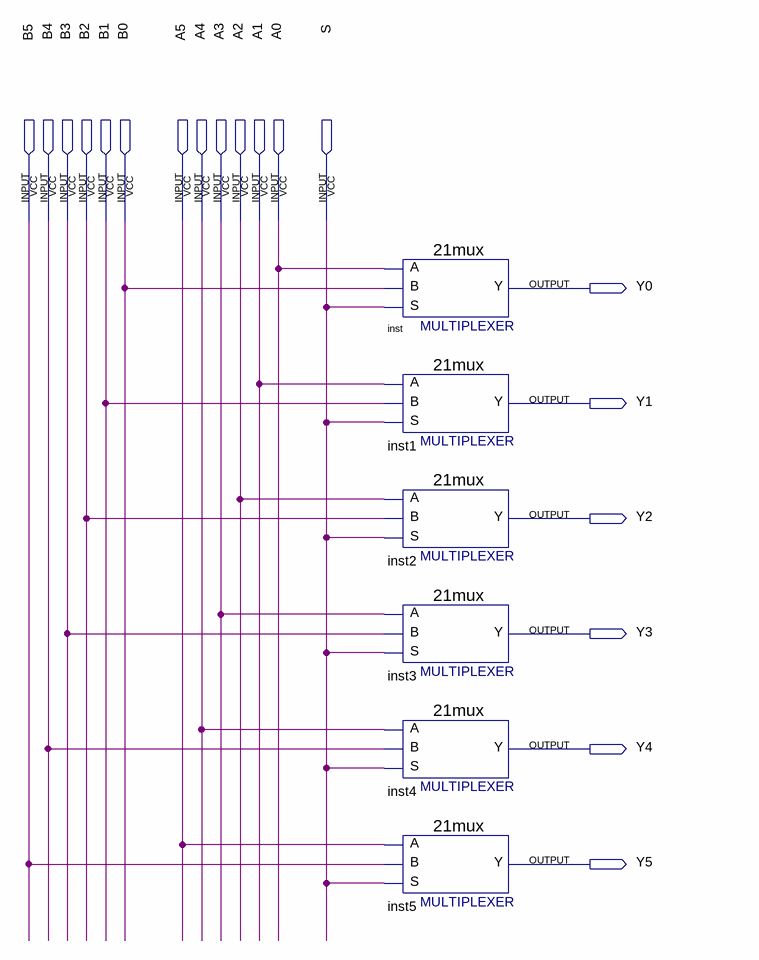
[diagram p0: schematic sheet]
// Quartus schematic mux6.bdf as structural Verilog: 6 symbols, 19 pins
module mux6 (
  input  B5,
  input  B4,
  input  B3,
  input  B2,
  input  B1,
  input  B0,
  input  A5,
  input  A4,
  input  A3,
  input  A2,
  input  A1,
  input  A0,
  input  S,
  output Y0,
  output Y1,
  output Y2,
  output Y3,
  output Y4,
  output Y5
);

  \21mux  inst (.S(S), .B(B0), .A(A0), .Y(Y0));
  \21mux  inst1 (.S(S), .B(B1), .A(A1), .Y(Y1));
  \21mux  inst2 (.S(S), .B(B2), .A(A2), .Y(Y2));
  \21mux  inst3 (.S(S), .B(B3), .A(A3), .Y(Y3));
  \21mux  inst4 (.S(S), .B(B4), .A(A4), .Y(Y4));
  \21mux  inst5 (.S(S), .B(B5), .A(A5), .Y(Y5));
endmodule
